# EAGLE design adaptor (EAGLE 6.6.0)
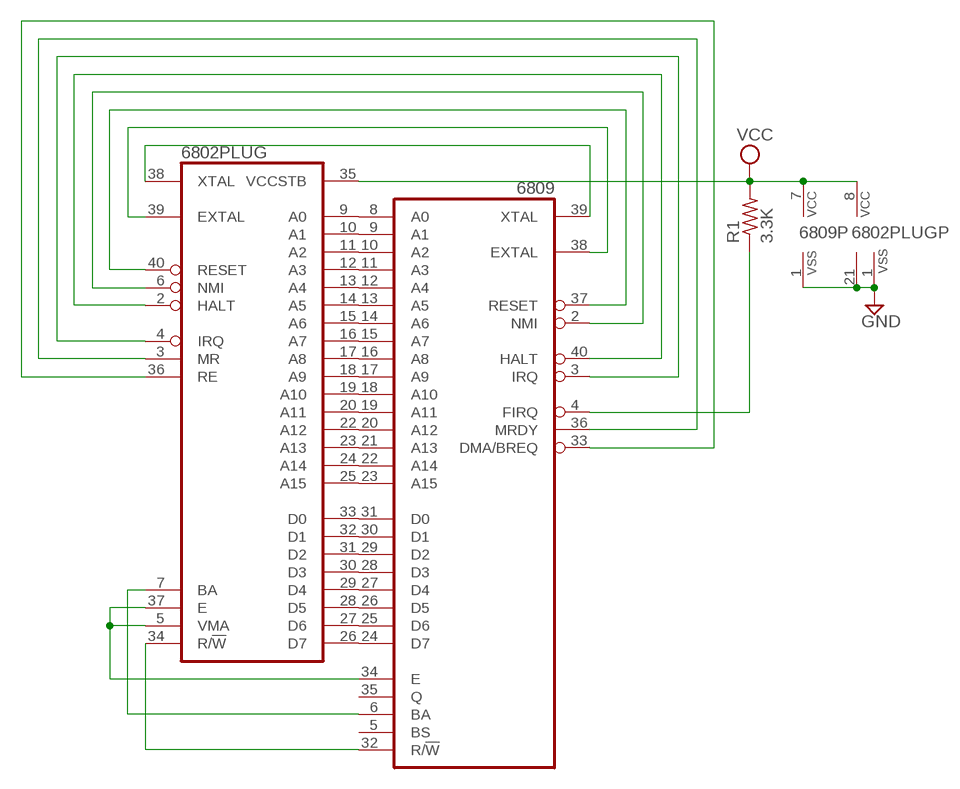
[diagram p0: schematic, sheet 1]

## Parts
6802PLUG  6802  [DIL40]
6809  6809  [DIL40]
R1  3.3K  R-US_0207/10  [0207/10]

## Nets
GND: 6802PLUG.1(VSS) 6802PLUG.21(VSS) 6809.1(VSS)
N$1: 6802PLUG.9(A0) 6809.8(A0)
N$2: 6802PLUG.10(A1) 6809.9(A1)
N$3: 6802PLUG.11(A2) 6809.10(A2)
N$4: 6802PLUG.12(A3) 6809.11(A3)
N$5: 6802PLUG.13(A4) 6809.12(A4)
N$6: 6802PLUG.14(A5) 6809.13(A5)
N$7: 6802PLUG.15(A6) 6809.14(A6)
N$8: 6802PLUG.16(A7) 6809.15(A7)
N$9: 6802PLUG.17(A8) 6809.16(A8)
N$10: 6802PLUG.18(A9) 6809.17(A9)
N$11: 6802PLUG.19(A10) 6809.18(A10)
N$12: 6802PLUG.20(A11) 6809.19(A11)
N$13: 6802PLUG.22(A12) 6809.20(A12)
N$14: 6802PLUG.23(A13) 6809.21(A13)
N$15: 6802PLUG.24(A14) 6809.22(A14)
N$16: 6802PLUG.25(A15) 6809.23(A15)
N$17: 6802PLUG.26(D7) 6809.24(D7)
N$18: 6802PLUG.27(D6) 6809.25(D6)
N$19: 6802PLUG.28(D5) 6809.26(D5)
N$20: 6802PLUG.29(D4) 6809.27(D4)
N$21: 6802PLUG.30(D3) 6809.28(D3)
N$22: 6802PLUG.31(D2) 6809.29(D2)
N$23: 6802PLUG.32(D1) 6809.30(D1)
N$24: 6802PLUG.33(D0) 6809.31(D0)
N$25: 6802PLUG.34(R/!W) 6809.32(R/!W)
N$26: 6802PLUG.7(BA) 6809.6(BA)
N$27: 6802PLUG.5(VMA) 6802PLUG.37(E) 6809.34(E)
N$28: 6802PLUG.38(XTAL) 6809.39(XTAL)
N$29: 6802PLUG.39(EXTAL) 6809.38(EXTAL)
N$30: 6802PLUG.40(RESET) 6809.37(RESET)
N$31: 6802PLUG.6(NMI) 6809.2(NMI)
N$32: 6802PLUG.2(HALT) 6809.40(HALT)
N$33: 6802PLUG.4(IRQ) 6809.3(IRQ)
N$34: 6802PLUG.3(MR) 6809.36(MRDY)
N$35: 6802PLUG.36(RE) 6809.33(DMA/BREQ)
N$36: 6809.4(FIRQ) R1.1
VCC: 6802PLUG.8(VCC) 6802PLUG.35(VCCSTB) 6809.7(VCC) R1.2
Unconnected: 6809.5(BS) 6809.35(Q)

## Library data of the parts
6802PLUG = micro-motorola:6802: MICROCONTROLLER/MEMORY DEVICE; OC_FARNELL: unknown; OC_NEWARK: unknown
6809 = micro-motorola:6809: MICROCONTROLLER/MEMORY DEVICE; MF: NTE ELECTRONICS; MPN: NTE6809; OC_FARNELL: 4530354; OC_NEWARK: 31C2459
R1 = rcl:R-US_: RESISTOR, American symbol

## Board
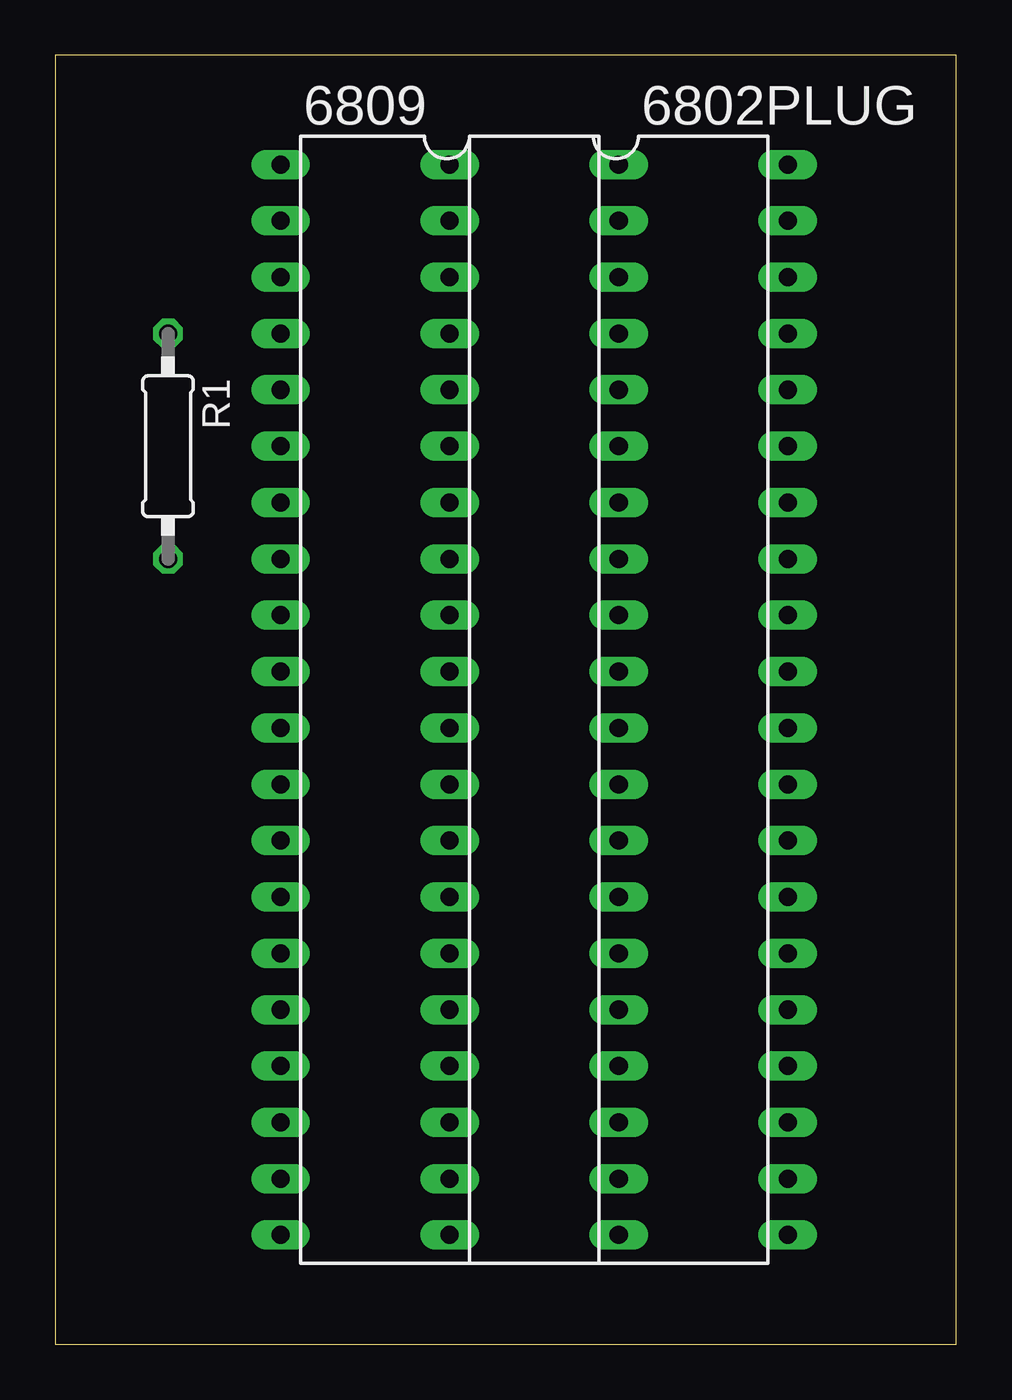
[diagram p1: board, top side]
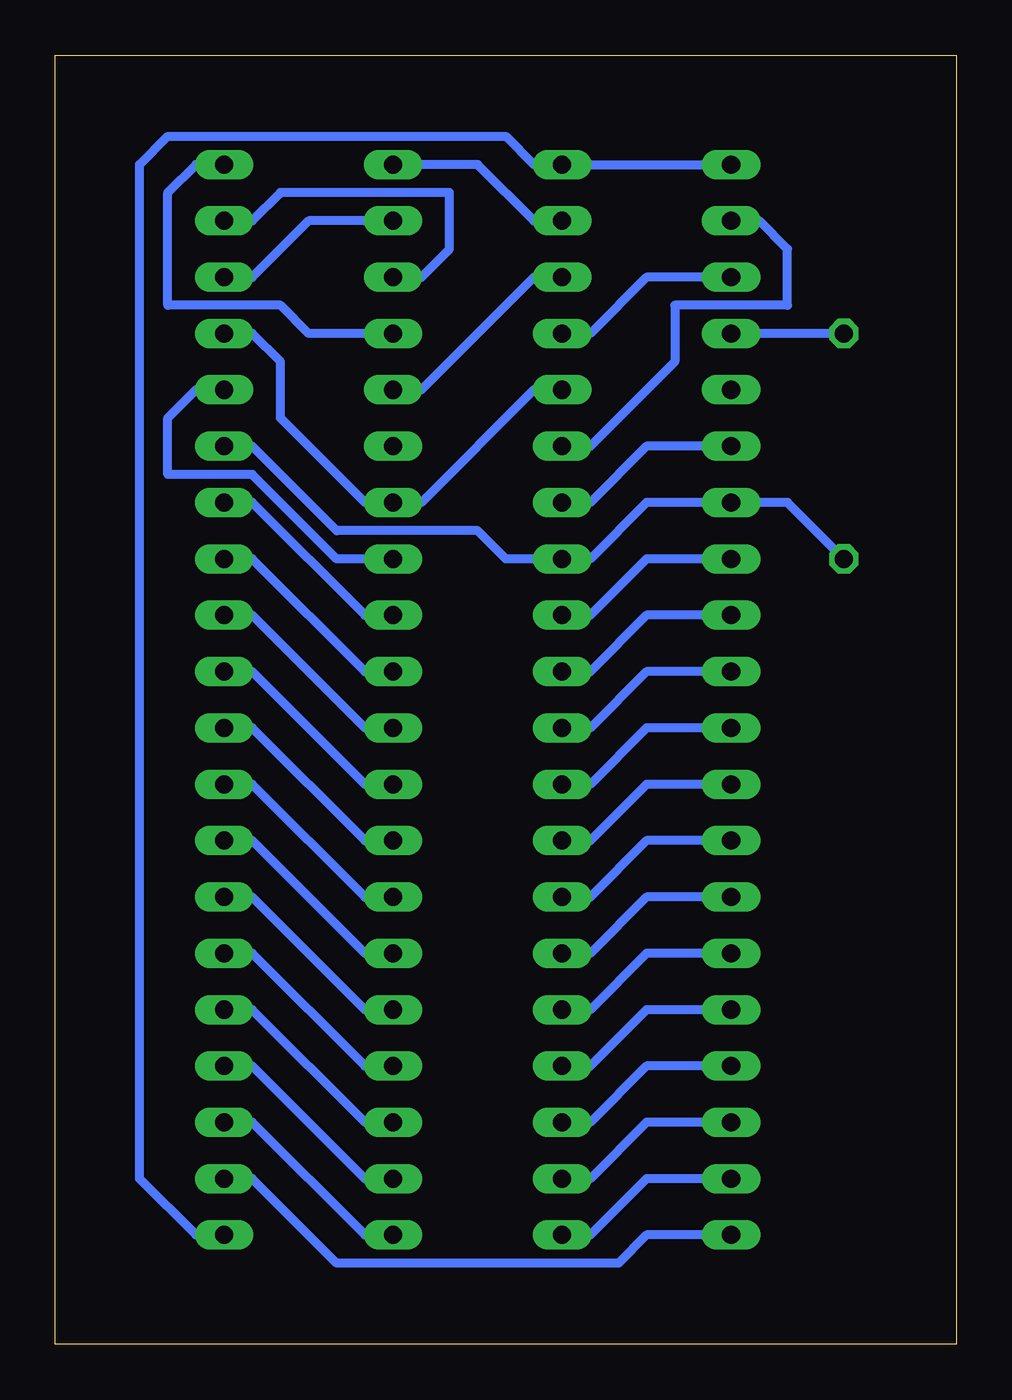
[diagram p2: board, bottom side, seen from below]

Size 40.62 x 58.09 mm. Coordinates in mm from the lower left corner, seen from the top.
Outline: 0,0 40.62,0 40.62,58.09 0,58.09 0,0
Copper layers (1+16): Top 0.035mm / dielectric 1.5mm / Bottom 0.035mm
Design rules "16mils": minimum track width 16mil, minimum drill 32mil, track to track 15mil, track to pad 10mil, pad to pad 10mil, via to via 10mil, smd to smd 10mil, copper to edge 13mil, drill to drill 10mil, minimum pad ring 10mil, minimum via ring 8mil, stop-mask expansion 0mil, vias tented up to drill 0mil, thermal gap 10mil

### Footprints (pad centres in the part's own frame; a part is rotated, then mirrored left to right if it is on the bottom)
DIL40 = drill 0.813 long: 1 -24.13,-7.62; 2 -21.59,-7.62; 3 -19.05,-7.62; 4 -16.51,-7.62; 5 -13.97,-7.62; 6 -11.43,-7.62; 7 -8.89,-7.62; 8 -6.35,-7.62; 9 -3.81,-7.62; 10 -1.27,-7.62; 11 1.27,-7.62; 12 3.81,-7.62; 13 6.35,-7.62; 14 8.89,-7.62; 15 11.43,-7.62; 16 13.97,-7.62; 17 16.51,-7.62; 18 19.05,-7.62; 19 21.59,-7.62; 20 24.13,-7.62; 21 24.13,7.62; 22 21.59,7.62; 23 19.05,7.62; 24 16.51,7.62; 25 13.97,7.62; 26 11.43,7.62; 27 8.89,7.62; 28 6.35,7.62; 29 3.81,7.62; 30 1.27,7.62; 31 -1.27,7.62; 32 -3.81,7.62; 33 -6.35,7.62; 34 -8.89,7.62; 35 -11.43,7.62; 36 -13.97,7.62; 37 -16.51,7.62; 38 -19.05,7.62; 39 -21.59,7.62; 40 -24.13,7.62
0207/10 = drill 0.813 octagon: 1 -5.08,0; 2 5.08,0

### Placement (x,y rotation side)
6802PLUG  25.39,29.05 270 top
6809  17.78,29.05 270 top
R1  5.08,40.48 270 top

### Tracks (layer width: path | path; a pad name or v marks a point on that pad's centre or on a via)
GND
  Bottom 0.406: 6802PLUG.21 34.28,4.92 36.82,7.46 36.82,53.18 35.55,54.45 20.32,54.45 19.05,53.18 6802PLUG.1 16.51,53.18 11.42,53.18 6809.1
N$1
  Bottom 0.406: 6809.8 13.96,35.4 16.51,32.86 6802PLUG.9
N$2
  Bottom 0.406: 6809.9 11.42,32.86 13.96,32.86 16.51,30.32 6802PLUG.10
N$3
  Bottom 0.406: 6809.10 11.42,30.32 13.96,30.32 16.51,27.78 6802PLUG.11
N$4
  Bottom 0.406: 6809.11 11.42,27.78 13.96,27.78 16.51,25.23 6802PLUG.12
N$5
  Bottom 0.406: 6809.12 11.42,25.23 13.96,25.23 16.51,22.7 6802PLUG.13
N$6
  Bottom 0.406: 6809.13 11.42,22.7 13.96,22.7 16.51,20.16 6802PLUG.14
N$7
  Bottom 0.406: 6809.14 11.42,20.16 13.96,20.16 16.51,17.62 6802PLUG.15
N$8
  Bottom 0.406: 6809.15 11.42,17.62 13.96,17.62 16.51,15.08 6802PLUG.16
N$9
  Bottom 0.406: 6809.16 11.42,15.08 13.96,15.08 16.51,12.54 6802PLUG.17
N$10
  Bottom 0.406: 6809.17 11.42,12.54 13.96,12.54 16.51,10 6802PLUG.18
N$11
  Bottom 0.406: 6809.18 11.42,10 13.96,10 16.51,7.46 6802PLUG.19
N$12
  Bottom 0.406: 6809.19 11.42,7.46 13.96,7.46 16.51,4.92 6802PLUG.20
N$13
  Bottom 0.406: 6809.20 11.42,4.92 13.96,4.92 15.23,3.65 27.94,3.65 31.75,7.46 6802PLUG.22
N$14
  Bottom 0.406: 6809.21 26.67,4.92 31.75,10 6802PLUG.23
N$15
  Bottom 0.406: 6809.22 26.67,7.46 31.75,12.54 6802PLUG.24
N$16
  Bottom 0.406: 6809.23 26.67,10 31.75,15.08 6802PLUG.25
N$17
  Bottom 0.406: 6809.24 26.67,12.54 31.75,17.62 6802PLUG.26
N$18
  Bottom 0.406: 6809.25 26.67,15.08 31.75,20.16 6802PLUG.27
N$19
  Bottom 0.406: 6809.26 26.67,17.62 31.75,22.7 6802PLUG.28
N$20
  Bottom 0.406: 6809.27 26.67,20.16 31.75,25.23 6802PLUG.29
N$21
  Bottom 0.406: 6809.28 26.67,22.7 31.75,27.78 6802PLUG.30
N$22
  Bottom 0.406: 6809.29 26.67,25.23 31.75,30.32 6802PLUG.31
N$23
  Bottom 0.406: 6809.30 26.67,27.78 31.75,32.86 6802PLUG.32
N$24
  Bottom 0.406: 6809.31 26.67,30.32 31.75,35.4 6802PLUG.33
N$25
  Bottom 0.406: 6809.32 26.67,32.86 31.75,37.94 6802PLUG.34
N$26
  Bottom 0.406: 6809.6 11.42,40.48 13.96,40.48 16.51,37.94 6802PLUG.7
N$27
  Bottom 0.406: 6802PLUG.37 31.75,45.55 30.48,44.29 30.48,41.74 26.67,37.94 6809.34 24.12,37.94 19.05,43.02 6802PLUG.5
N$28
  Bottom 0.406: 6809.39 26.67,50.63 29.21,50.63 31.75,48.09 6802PLUG.38
N$29
  Bottom 0.406: 6809.38 24.12,48.09 22.86,49.37 22.86,51.91 30.48,51.91 31.75,50.63 6802PLUG.39
N$30
  Bottom 0.406: 6809.37 26.67,45.55 29.21,45.55 30.48,46.83 35.55,46.83 35.55,51.91 34.28,53.18 6802PLUG.40
N$31
  Bottom 0.406: 6802PLUG.6 16.51,40.48 12.69,44.29 12.69,46.83 7.62,46.83 7.62,49.37 8.88,50.63 6809.2
N$32
  Bottom 0.406: 6802PLUG.2 19.05,50.63 21.59,53.18 24.12,53.18 6809.40
N$33
  Bottom 0.406: 6809.3 11.42,48.09 13.96,48.09 16.51,45.55 6802PLUG.4
N$34
  Bottom 0.406: 6802PLUG.3 19.05,48.09 24.12,43.02 6809.36
N$35
  Bottom 0.406: 6809.33 27.94,35.4 31.75,39.2 35.55,39.2 35.55,41.74 34.28,43.02 6802PLUG.36
N$36
  Bottom 0.406: R1.1 8.88,45.55 6809.4
VCC
  Bottom 0.406: R1.2 7.62,37.94 6809.7 13.96,37.94 16.51,35.4 6802PLUG.8 20.32,35.4 21.59,36.66 27.94,36.66 31.75,40.48 6802PLUG.35